# Altium schematic sheet RF6886 Amplifier.SchDoc: RF6886 Amplifier
size Letter; SheetNumber: 3; SheetTotal: 11
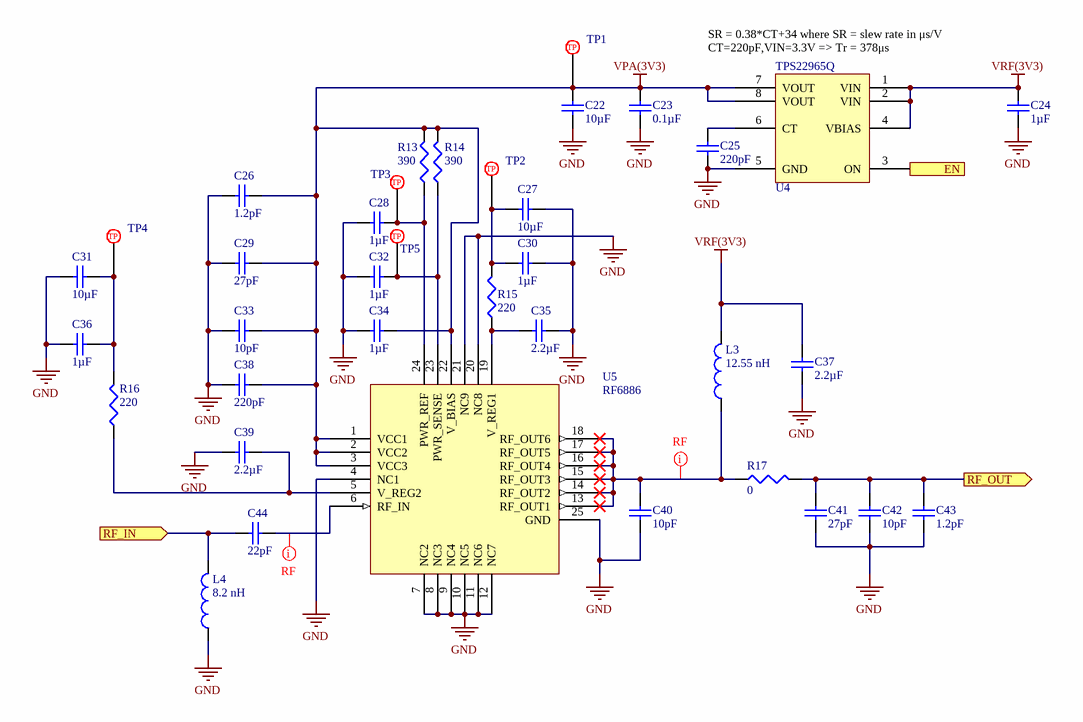
[diagram p0: RF6886 Amplifier.SchDoc]

## Parts
C22  value 10µF  [TDK-CGA5L]  (hidden comment: Cap)
C23  value 0.1µF  [TDK-CGA2B]  (hidden comment: Cap)
C24  value 1µF  [TDK-CGA3E]  (hidden comment: Cap)
C25  value 220pF  [TDK-CGA2B]  (hidden comment: Cap)
C26  value 1.2pF  [ATC-600S]  (hidden comment: Cap)
C27  value 10µF  [TDK-CGA5L]  (hidden comment: Cap)
C28  value 1µF  [TDK-CGA3E]  (hidden comment: Cap)
C29  value 27pF  [ATC-600S]  (hidden comment: Cap)
C30  value 1µF  [TDK-CGA3E]  (hidden comment: Cap)
C31  value 10µF  [TDK-CGA5L]  (hidden comment: Cap)
C32  value 1µF  [TDK-CGA3E]  (hidden comment: Cap)
C33  value 10pF  [ATC-600S]  (hidden comment: Cap)
C34  value 1µF  [TDK-CGA3E]  (hidden comment: Cap)
C35  value 2.2µF  [TDK-CGA4J]  (hidden comment: Cap)
C36  value 1µF  [TDK-CGA3E]  (hidden comment: Cap)
C37  value 2.2µF  [TDK-CGA4J]  (hidden comment: Cap)
C38  value 220pF  [ATC-600F]  (hidden comment: Cap)
C39  value 2.2µF  [TDK-CGA4J]  (hidden comment: Cap)
C40  value 10pF  [ATC-600L]  (hidden comment: Cap)
C41  value 27pF  [ATC-600L]  (hidden comment: Cap)
C42  value 10pF  [ATC-600L]  (hidden comment: Cap)
C43  value 1.2pF  [ATC-600L]  (hidden comment: Cap)
C44  value 22pF  [ATC-600L]  (hidden comment: Cap)
L3  value 12.55 nH  [1606-10GLC]  (hidden comment: 2 % tolerence)
L4  value 8.2 nH  [CCI-0402CS]  (hidden comment: 0402CS-8N2XGLW)
R13  value 390  [PANA-ERA2A]  (hidden comment: Res3)
R14  value 390  [PANA-ERA2A]  (hidden comment: Res3)
R15  value 220  [PANA-ERA3A]  (hidden comment: Res3)
R16  value 220  [PANA-ERA3A]  (hidden comment: Res3)
R17  value 0  [PANA-ERJ2G]  (hidden comment: Jumper)
TP1  5017  [KS-5017]  (value not drawn)
TP2  5017  [KS-5017]  (value not drawn)
TP3  5017  [KS-5017]  (value not drawn)
TP4  5017  [KS-5017]  (value not drawn)
TP5  5017  [KS-5017]  (value not drawn)
U4  TPS22965Q  [TI-DSG0008]
U5  RF6886  [24-VFQFN]

## Ports
EN (in), RF_IN (in), RF_OUT (out)

## Nets
GND: C22.2 C23.1 C24.1 C25.1 C26.1 C27.2 C28.2 C29.1 C30.1 C31.1 C32.2 C33.1 C34.2 C35.1 C36.2 C37.1 C38.1 C39.2 C40.1 C41.1 C42.1 C43.1 L4.1 U4.5(GND) U5.4(NC1) U5.7(NC2) U5.8(NC3) U5.9(NC4) U5.10(NC5) U5.11(NC6) U5.12(NC7) U5.20(NC8) U5.21(NC9) U5.25(GND)
VPA(3V3): C22.1 C23.2 C26.2 C29.2 C33.2 C34.1 C38.2 R13.2 R14.2 TP1.1 U4.7(VOUT) U4.8(VOUT) U5.1(VCC1) U5.2(VCC2) U5.3(VCC3) U5.22(V_BIAS)
VRF(3V3): C24.2 C37.2 L3.2 U4.1(VIN) U4.2(VIN) U4.4(VBIAS)
EN: U4.3(ON) ; port EN
RF_IN: C44.1 L4.2 ; port RF_IN
RF_OUT: C41.2 C42.2 C43.2 R17.2 ; port RF_OUT
NetC25_2: C25.2 U4.6(CT)
NetC27_1: C27.1 C30.2 R15.2 TP2.1
NetC28_1: C28.1 R13.1 TP3.1 U5.24(PWR_REF)
NetC31_2: C31.2 C36.1 R16.2 TP4.1
NetC32_1: C32.1 R14.1 TP5.1 U5.23(PWR_SENSE)
NetC35_2: C35.2 R15.1 U5.19(V_REG1)
NetC39_1: C39.1 R16.1 U5.5(V_REG2)
NetC40_2: C40.2 L3.1 R17.1 U5.13(RF_OUT1) U5.14(RF_OUT2) U5.15(RF_OUT3) U5.16(RF_OUT4) U5.17(RF_OUT5) U5.18(RF_OUT6)
NetC44_2: C44.2 U5.6(RF_IN)

## Layout directives
net class RF; rule Impedance Constraint [Min = 50.00    Max = 50.00    ]: NetC40_2, NetC44_2

## Notes on the sheet
- SR = 0.38*CT+34 where SR = slew rate in μs/V
- (near U4) CT=220pF,VIN=3.3V => Tr = 378μs
- (the "License"); you may not use or redistribute this file except in compliance with the License. You
- This file and the information within it are licensed under the terms of the Apache License, Version 2.0
- Copyright
- Unless required by applicable law or agreed to in writing, content distributed under the License is
- distributed on an "AS IS" BASIS, WITHOUT WARRANTIES OR CONDITIONS OF ANY KIND,
- either express or implied. See the License for the specific language governing permissions and
- limitations under the License.
- may obtain a copy of the License at:
- http://www.apache.org/licenses/LICENSE-2.0
- Title
- Size:
- Date:
- Letter
- Number:
- Time:
- Revision:
- Sheet
- of
- University of Alberta
- Deptartment of Electrical
- and Computer Engineering
- Edmonton AB, Canada
- T6G 1H9
- File:
- (in symbol PTP-KS-00001) TP

## Library data of the parts
C22 C27 C31 = PC-TDK-02917: CAP CER 10UF 25V X7R 1206; Manufacturer Part Number: CGA5L1X7R1E106K160AC; Index: 2917; Tolerance: ±10%; Published: 3/16/2016; LatestRevisionDate: 3/16/2016; LatestRevisionNote: ...; PackageReference: 1206 (3216 Metric); Publisher: AlbertaSat; PackageDescription: Radial Cap, Thru-Hole; 2 Leads; 0.3 in Pin Spacing; Part Number: PC-TDK-02917; Supplier Part Number 1: 445-6990-1-ND; Supplier 1: Digi-key; Supplier Link: http://www.digikey.ca/product-search/en?keywords=445-6990-1-ND; Voltage - Rated: 25V; Temperature Coefficient: X7R; Applications: Automotive
C23 = PC-TDK-02259: CAP CER 0.1UF 50V X7R 0402; Manufacturer Part Number: CGA2B3X7R1H104K050BB; Index: 2259; Designator: C?; Tolerance: ±10%; Published: 2016-03-16; LatestRevisionDate: 2016-03-16; LatestRevisionNote: ...; PackageReference: 0402 (1005 Metric); Publisher: AlbertaSat; PackageDescription: Radial Cap, Thru-Hole; 2 Leads; 0.3 in Pin Spacing; Part Number: PC-TDK-02259; Supplier Part Number 1: 445-6899-1-ND; Supplier 1: Digi-key; Supplier Link: http://www.digikey.ca/product-search/en?keywords=445-6899-1-ND; Voltage - Rated: 50V; Temperature Coefficient: X7R; Applications: Automotive
C24 C28 C30 C32 C34 C36 = PC-TDK-02603: CAP CER 1UF 25V X7R 0603; Manufacturer Part Number: CGA3E1X7R1E105K080AC; Index: 2603; Designator: C?; Tolerance: ±10%; Published: 2016-03-16; LatestRevisionDate: 2016-03-16; LatestRevisionNote: ...; PackageReference: 0603 (1608 Metric); Publisher: AlbertaSat; PackageDescription: Radial Cap, Thru-Hole; 2 Leads; 0.3 in Pin Spacing; Part Number: PC-TDK-02603; Supplier Part Number 1: 445-6931-1-ND; Supplier 1: Digi-key; Supplier Link: http://www.digikey.ca/product-search/en?keywords=445-6931-1-ND; Voltage - Rated: 25V; Temperature Coefficient: X7R; Applications: Automotive
C25 = PC-TDK-01303: CAP CER 220PF 50V NP0 0402; Manufacturer Part Number: CGA2B2NP01H221J050BA; Index: 1303; Designator: C?; Tolerance: ±5%; Published: 2016-03-16; LatestRevisionDate: 2016-03-16; LatestRevisionNote: ...; PackageReference: 0402 (1005 Metric); Publisher: AlbertaSat; PackageDescription: Radial Cap, Thru-Hole; 2 Leads; 0.3 in Pin Spacing; Part Number: PC-TDK-01303; Supplier Part Number 1: 445-12129-1-ND; Supplier 1: Digi-key; Supplier Link: http://www.digikey.ca/product-search/en?keywords=445-12129-1-ND; Voltage - Rated: 50V; Temperature Coefficient: NP0; Applications: Automotive
C26 = PC-ATC-00072: CAP CER 1.2PF 250V C0G/NP0 0603; Manufacturer Part Number: 600S1R2AW250XT; Index: 72; Designator: C?; Tolerance: ±0.05pF; Temperature Coefficient: C0G, NP0; Published: 2018-08-29; LatestRevisionDate: 2018-08-29; LatestRevisionNote: ...; PackageReference: 0603 (1608 Metric); Publisher: AlbertaSat; PackageDescription: Radial Cap, Thru-Hole; 2 Leads; 0.3 in Pin Spacing; Part Number: PC-ATC-00072; Supplier Part Number 1: 1284-1721-1-ND; Supplier 1: Digi-key; Supplier Link: https://www.digikey.ca/products/en?keywords=1284-1721-1-ND; Voltage - Rated: 250V; Applications: High Q, Low Loss, Ultra Low ESR
C29 = PC-ATC-00302: CAP CER 27PF 250V NP0 0603; Manufacturer Part Number: 600S270FW250XT; Index: 302; Designator: C?; Tolerance: ±1%; Temperature Coefficient: C0G, NP0; Published: 2018-08-29; LatestRevisionDate: 2018-08-29; LatestRevisionNote: ...; PackageReference: 0603 (1608 Metric); Publisher: AlbertaSat; PackageDescription: Radial Cap, Thru-Hole; 2 Leads; 0.3 in Pin Spacing; Part Number: PC-ATC-00302; Supplier Part Number 1: 1284-1876-1-ND; Supplier 1: Digi-key; Supplier Link: https://www.digikey.ca/products/en?keywords=1284-1876-1-ND; Voltage - Rated: 250V; Applications: High Q, Low Loss, Ultra Low ESR
C33 = PC-ATC-00234: CAP CER 10PF 250V C0G/NP0 0603; Manufacturer Part Number: 600S100FW250XT; Index: 234; Designator: C?; Tolerance: ±1%; Temperature Coefficient: C0G, NP0; Published: 2018-08-29; LatestRevisionDate: 2018-08-29; LatestRevisionNote: ...; PackageReference: 0603 (1608 Metric); Publisher: AlbertaSat; PackageDescription: Radial Cap, Thru-Hole; 2 Leads; 0.3 in Pin Spacing; Part Number: PC-ATC-00234; Supplier Part Number 1: 1284-1159-1-ND; Supplier 1: Digi-key; Supplier Link: https://www.digikey.ca/products/en?keywords=1284-1159-1-ND; Voltage - Rated: 250V; Applications: High Q, Low Loss, Ultra Low ESR
C35 C37 C39 = PC-TDK-02742: CAP CER 2.2UF 50V X7R 0805; Manufacturer Part Number: CGA4J3X7R1H225K125AB; Index: 2742; Designator: C?; Tolerance: ±10%; Published: 2016-03-16; LatestRevisionDate: 2016-03-16; LatestRevisionNote: ...; PackageReference: 0805 (2012 Metric); Publisher: AlbertaSat; PackageDescription: Radial Cap, Thru-Hole; 2 Leads; 0.3 in Pin Spacing; Part Number: PC-TDK-02742; Supplier Part Number 1: 445-174216-1-ND; Supplier 1: Digi-key; Supplier Link: http://www.digikey.ca/product-search/en?keywords=445-174216-1-ND; Voltage - Rated: 50V; Temperature Coefficient: X7R; Applications: Automotive
C38 = PC-ATC-00379: CAP CER 220PF 250V C0G/NP0 0805; Manufacturer Part Number: 600F221JT250XT; Index: 379; Designator: C?; Tolerance: ±5%; Temperature Coefficient: C0G, NP0; Published: 2018-08-29; LatestRevisionDate: 2018-08-29; LatestRevisionNote: ...; PackageReference: 0805 (2012 Metric); Publisher: AlbertaSat; PackageDescription: Radial Cap, Thru-Hole; 2 Leads; 0.3 in Pin Spacing; Part Number: PC-ATC-00379; Supplier Part Number 1: 1284-1038-1-ND; Supplier 1: Digi-key; Supplier Link: https://www.digikey.ca/products/en?keywords=1284-1038-1-ND; Voltage - Rated: 250V; Applications: High Q, Low Loss, Ultra Low ESR
C40 C42 = PC-ATC-00229: CAP CER 10PF 200V C0G/NP0 0402; Manufacturer Part Number: 600L100FT200T; Index: 229; Designator: C?; Tolerance: ±1%; Temperature Coefficient: C0G, NP0; Published: 2018-08-29; LatestRevisionDate: 2018-08-29; LatestRevisionNote: ...; PackageReference: 0402 (1005 Metric); Publisher: AlbertaSat; PackageDescription: Chip Capacitor, 2-Leads, Body 1.02x0.51mm, IPC Low Density; Part Number: PC-ATC-00229; Supplier Part Number 1: 1284-1095-1-ND; Supplier 1: Digi-key; Supplier Link: https://www.digikey.ca/products/en?keywords=1284-1095-1-ND; Voltage - Rated: 200V; Applications: High Q, Low Loss, Ultra Low ESR
C41 = PC-ATC-00299: CAP CER 27PF 200V C0G/NP0 0402; Manufacturer Part Number: 600L270FT200T; Index: 299; Designator: C?; Tolerance: ±1%; Temperature Coefficient: C0G, NP0; Published: 2018-08-29; LatestRevisionDate: 2018-08-29; LatestRevisionNote: ...; PackageReference: 0402 (1005 Metric); Publisher: AlbertaSat; PackageDescription: Chip Capacitor, 2-Leads, Body 1.02x0.51mm, IPC Low Density; Part Number: PC-ATC-00299; Supplier Part Number 1: 1284-1361-1-ND; Supplier 1: Digi-key; Supplier Link: https://www.digikey.ca/products/en?keywords=1284-1361-1-ND; Voltage - Rated: 200V; Applications: High Q, Low Loss, Ultra Low ESR
C43 = PC-ATC-00068: CAP CER 1.2PF 200V C0G/NP0 0402; Manufacturer Part Number: 600L1R2AT200T; Index: 68; Designator: C?; Tolerance: ±0.05pF; Temperature Coefficient: C0G, NP0; Published: 2018-08-29; LatestRevisionDate: 2018-08-29; LatestRevisionNote: ...; PackageReference: 0402 (1005 Metric); Publisher: AlbertaSat; PackageDescription: Chip Capacitor, 2-Leads, Body 1.02x0.51mm, IPC Low Density; Part Number: PC-ATC-00068; Supplier Part Number 1: 1284-1106-1-ND; Supplier 1: Digi-key; Supplier Link: https://www.digikey.ca/products/en?keywords=1284-1106-1-ND; Voltage - Rated: 200V; Applications: High Q, Low Loss, Ultra Low ESR
C44 = PC-ATC-00281: CAP CER 22PF 200V C0G/NP0 0402; Manufacturer Part Number: 600L220FT200T; Index: 281; Designator: C?; Tolerance: ±1%; Temperature Coefficient: C0G, NP0; Published: 2018-08-29; LatestRevisionDate: 2018-08-29; LatestRevisionNote: ...; PackageReference: 0402 (1005 Metric); Publisher: AlbertaSat; PackageDescription: Chip Capacitor, 2-Leads, Body 1.02x0.51mm, IPC Low Density; Part Number: PC-ATC-00281; Supplier Part Number 1: 1284-1114-1-ND; Supplier 1: Digi-key; Supplier Link: https://www.digikey.ca/products/en?keywords=1284-1114-1-ND; Voltage - Rated: 200V; Applications: High Q, Low Loss, Ultra Low ESR
L3 = PL-CCI-00006: Fixed Inductors 1606 Micro Spring 12.55 nH 2 % 1.6 A; Manufacturer Part Number: 1606-10GLB; Code_IEC: 1005; Index: 6; Designator: L?; Published: 2018-06-17; LatestRevisionDate: 2018-06-17; LatestRevisionNote: ...; PackageReference: 1606-10GLC; Publisher: AlbertaSat; PackageDescription: Fixed Inductors 0402CS AEC-Q200 8.2 nH 2 % 0.68 A; Code_JEITA: 0402; Part Number: PL-CCI-00006; Supplier Part Number 1: 994-1606-10GLB; Supplier 1: Mouser; Supplier Link: #https://www.mouser.ca/ProductDetail/Coilcraft/1606-10GLB?qs=zCSbvcPd3pYulo8k3gupGQ%3d%3d#; Inductance: 12.55 nH
L4 = PL-CCI-00010: Fixed Inductors 0402CS AEC-Q200 8.2 nH 2 % 0.68 AFixed Inductors 0402CS AEC-Q200 8.2 nH 2 % 0.68 A / Fixed Inductors 0402CS AEC-Q200 8.2 nH 2 % 0.68 AFixed Inductors 1606 Micro Spring 12.55 nH 2 % 1.6 A / Fixed Inductors 0402CS AEC-Q200 8.2 nH 2 % 0.68 A; Code_IEC: 1005; Index: 10; Designator: L?; Published: 2018-06-17; LatestRevisionDate: 2018-06-17; LatestRevisionNote: ...; PackageReference: 0402 (1005 Metric); Publisher: AlbertaSat; PackageDescription: Chip Inductor, 2-Leads, Body 1.02x0.51mm, IPC Low Density; Code_JEITA: 0402; Part Number: PL-CCI-00010; Manufacturer Part Number: 0402CS-8N2XGLW; Supplier Part Number 1: 994-0402CS-8N2XGLW; Supplier 1: Mouser; Supplier Part Number 2: 0402CS-8N2XGLW / 0402CS-8N2XGLW; Supplier 2: Coilcraft Direct; Supplier Link: #https://www.mouser.ca/ProductDetail/Coilcraft/0402CS-8N2XGLW?qs=sGAEpiMZZMsg%252by3WlYCkU2kWFds1hA9D5FCqTFjMuAs%3d#
R13 R14 = 14828: RES SMD 390 OHM 0.1% 1/16W 0402; Part Number: 14828; Manufacturer Part Number: ERA-2ARB391X; Designator: R?; Power: 0.063W, 1/16W; Temperature Coefficient: ±10ppm/°C; Published: 8-Jun-2000; LatestRevisionDate: 29-May-2009; LatestRevisionNote: IPC-7351 Footprint Added.; PackageReference: 0402 (1005 Metric); Publisher: Altium Limited; PackageDescription: Chip Resistor, 2-Leads, Body 1.00x0.50mm, IPC Low Density; Supplier Part Number 1: P390CPCT-ND; Supplier 1: Digi-Key; Supplier Link: http://www.digikey.ca/product-search/en?keywords=P390CPCT-ND; Tolerance: ±0.1%
R15 R16 = 14464: RES SMD 220 OHM 0.1% 1/10W 0603; Part Number: 14464; Manufacturer Part Number: ERA-3AEB221V; Power: 0.1W, 1/10W; Temperature Coefficient: ±25ppm/°C; Published: 8-Jun-2000; LatestRevisionDate: 29-May-2009; LatestRevisionNote: IPC-7351 Footprint Added.; PackageReference: 0603 (1608 Metric); Publisher: Altium Limited; PackageDescription: Chip Resistor, 2-Leads, Body 1.60x0.80mm, IPC Low Density; Supplier Part Number 1: P220DBCT-ND; Supplier 1: Digi-Key; Supplier Link: http://www.digikey.ca/product-search/en?keywords=P220DBCT-ND; Tolerance: ±0.1%
R17 = 13127: RES SMD 0.0OHM JUMPER 1/10W 0402; Part Number: 13127; Manufacturer Part Number: ERJ-2GE0R00X; Designator: R?; Power: 0.1W, 1/10W; PackageDescription: Chip Resistor, 2-Leads, Body 1.00x0.50mm, IPC Low Density; Supplier Part Number 1: P0.0JCT-ND; Supplier 1: Digi-Key; Supplier Link: http://www.digikey.ca/product-search/en?keywords=P0.0JCT-ND; PackageReference: 0402 (1005 Metric); Tolerance: Jumper; Temperature Coefficient: -; Type: Jumper
TP1-TP5 = PTP-KS-00001: PC TEST POINT MINI SMD; Index: 1; Designator: TP?; Supplier 1: Digi-key; Supplier 2: Newark; Supplier 3: Mouser; Part Number: PTP-KS-00001; Manufacturer Part Number: 5017; Supplier Part Number 1: 36-5017CT-ND; Publisher: AlbertaSat; Published: 2016-03-15; LatestRevisionDate: 2016-03-15; LatestRevisionNote: ...; PackageReference: KS-5017; PackageDescription: Testpoint Lug Mini SMD 27X10X152; Supplier Link: #http://www.digikey.ca/product-detail/en/keystone-electronics/5017/36-5017TR-ND/2217304#
U4 = 51: IC LOAD SWITCH 6A 8WSON; Part Number: 51; Manufacturer Part Number: TPS22965QWDSGTQ1; Designator: U?; Supplier Part Number 2: 595-TPS22965QWDSGRQ1; Supplier 2: Mouser; Supplier Part Number 1: 296-50067-1-ND; Supplier 1: Digi-Key; Supplier Link: #https://www.digikey.ca/product-detail/en/texas-instruments/TPS22965QWDSGTQ1/296-50067-1-ND/9462874#; PackageReference: 8-WFDFN Exposed Pad; Operating Temperature: -40°C ~ 125°C (TA)
U5 = PU-QRV-00001: RF Amplifier IC CDMA, GSM, EDGE 100MHz ~ 1GHz 24-LCC (4x4); Manufacturer Part Number: RF6886TR13; Index: 1; Designator: U?; Opperating Supply Current: 390 mA; Operating Frequency: 100MHz - 1 GHz; Gain: 31 dB; Operating Supply Voltage: 3.6 V; Part Number: PU-QRV-00001; Supplier Part Number 1: 772-RF6886; Supplier 1: Mouser; Supplier Part Number 2: RF6886TR13; Supplier 2: Avnet Asia; Publisher: AlbertaSat; Published: 2018-04-20; LatestRevisionDate: 2018-04-20; LatestRevisionNote: ...; PackageReference: 24-VFQFN Exposed Pad; PackageDescription: QFN-24; Supplier Link: #https://ca.mouser.com/ProductDetail/Qorvo/RF6886TR13?qs=sGAEpiMZZMuI1aKsGLfKZB%252b0jWhrXKds1WCZrINp87s%3d#; Operating Temperature: -40°C ~ 85°C (TA); Applications: General Purpose